# Altium schematic sheet EFR32xG1x_DISC_WIDEBAND_REF_DES_A00_01_Title_Page.SchDoc
size 420 x 297 mm
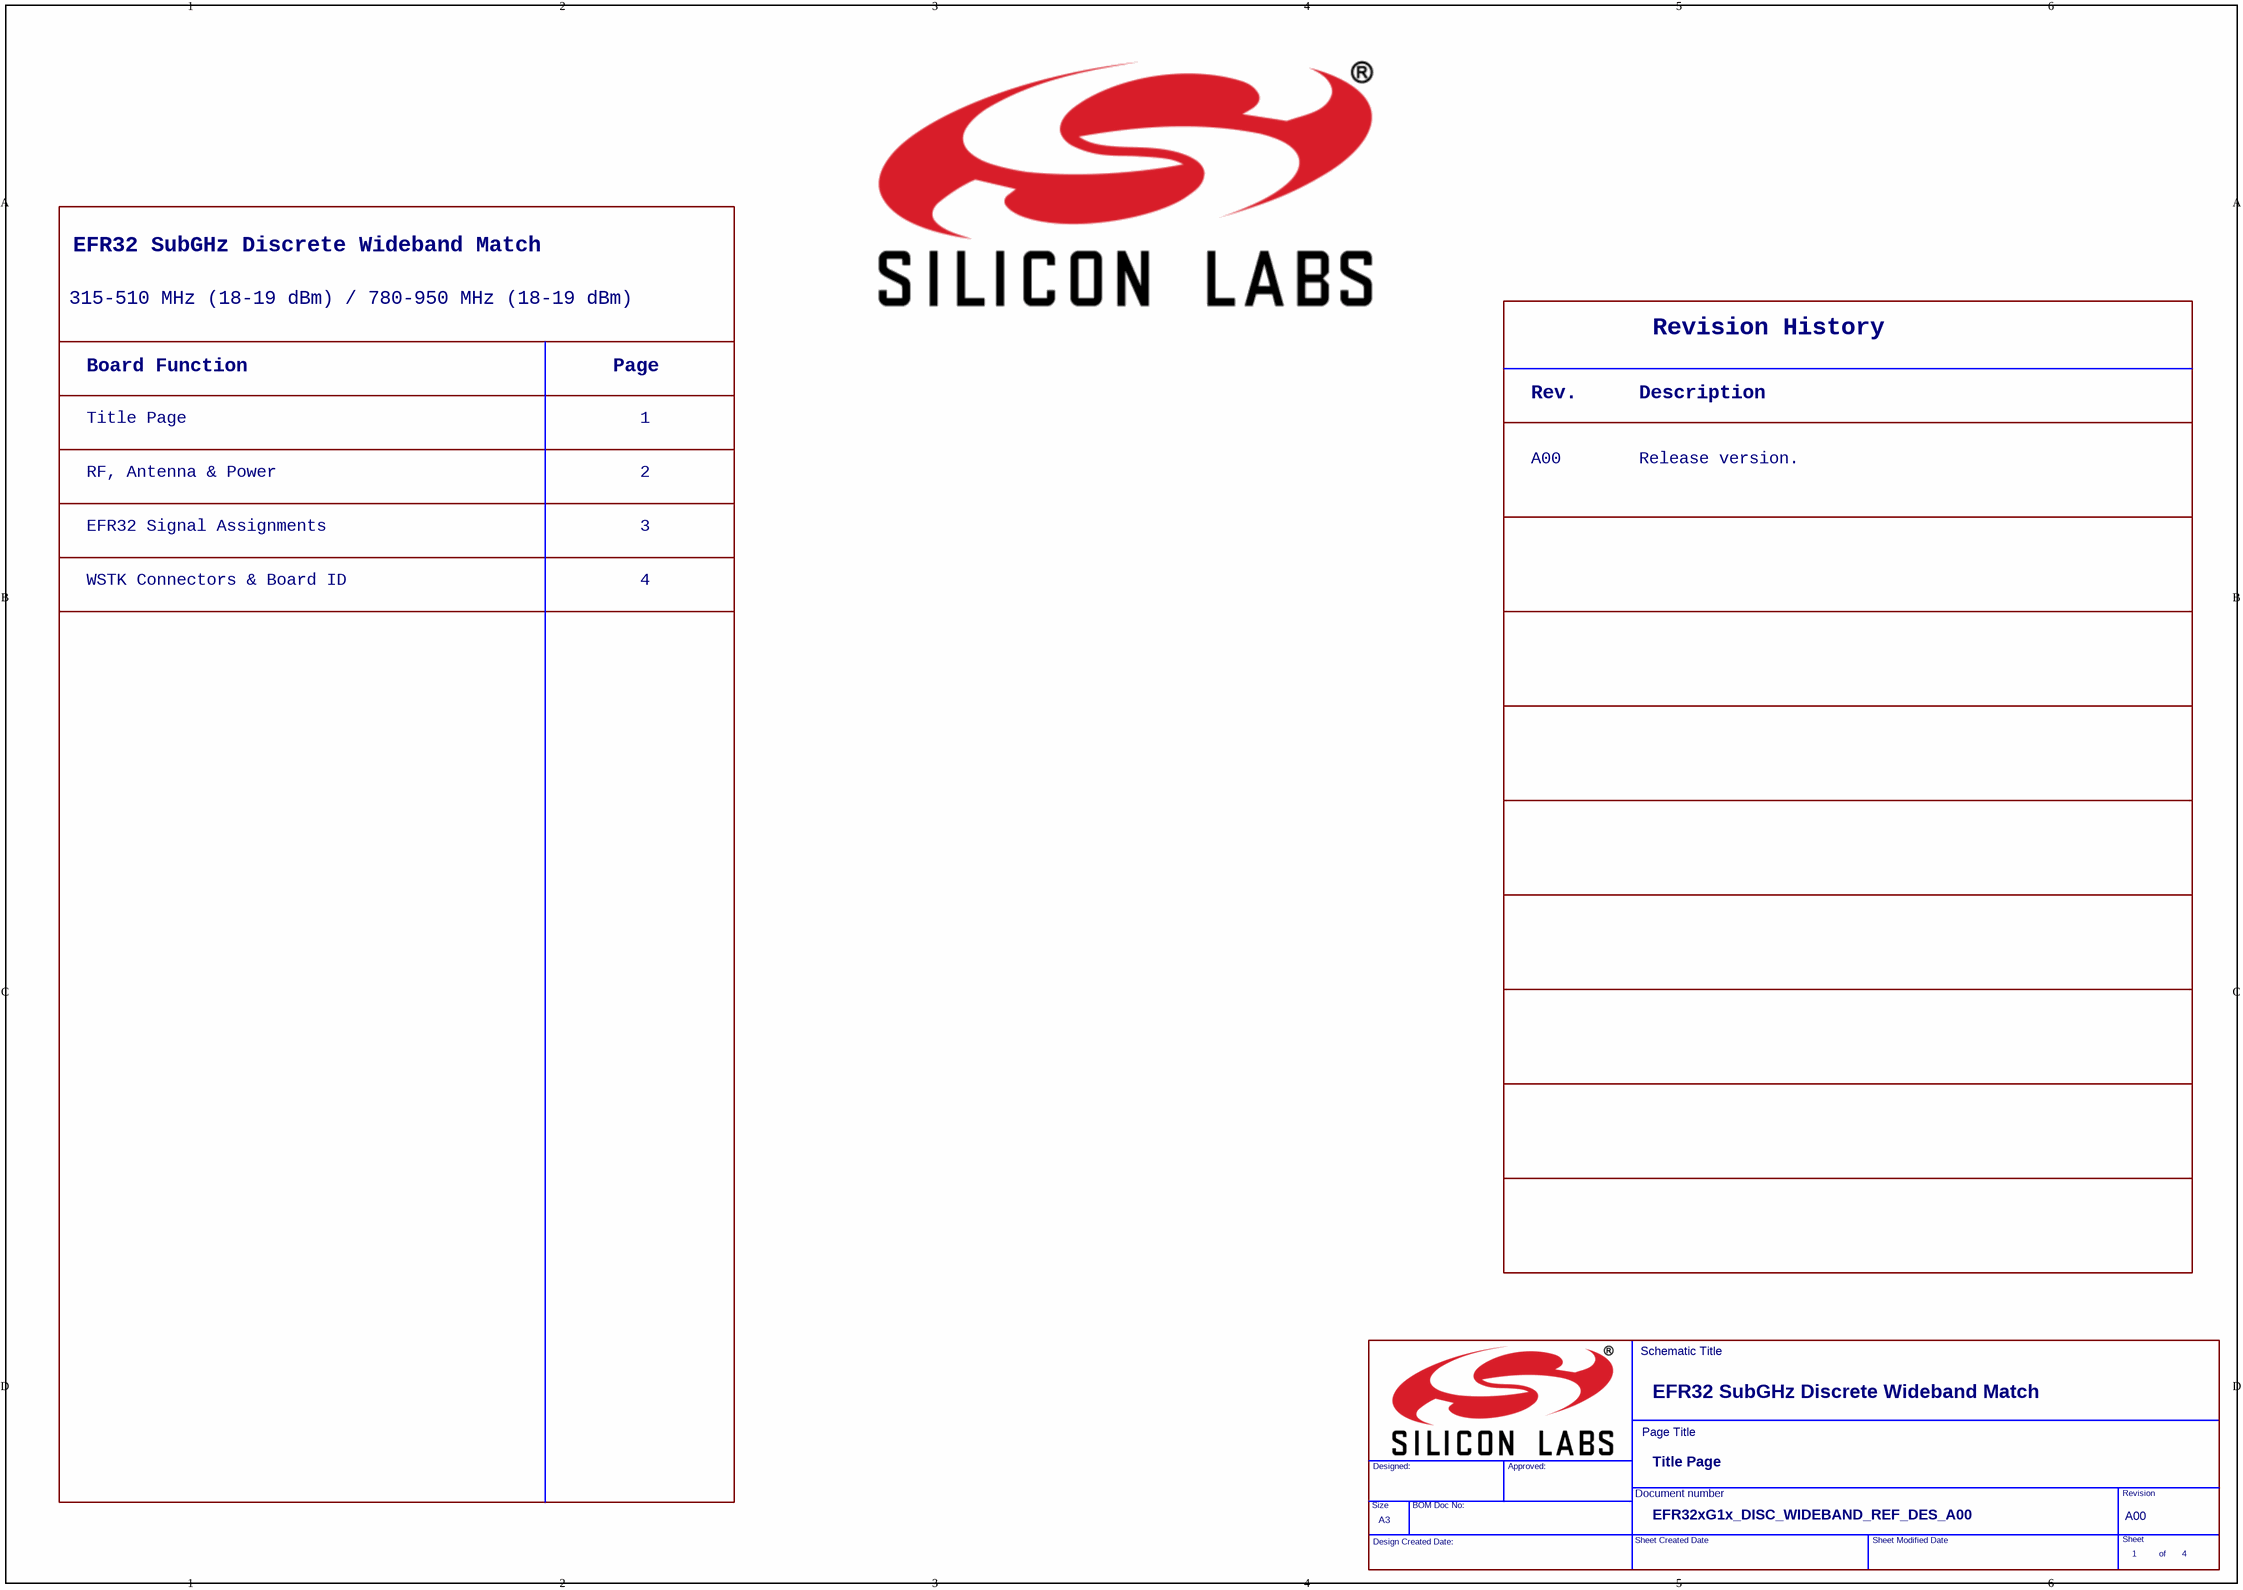
[diagram p0: EFR32xG1x_DISC_WIDEBAND_REF_DES_A00_01_Title_Page.SchDoc]

## Parts
(Parts that share a designator on the sheet are numbered #1, #2 ... from top to bottom, then left to right.)
*#1  Header A: EFR32 SubGHz Discrete Wideband Match  (hidden comment: Toc_Header)  (graphical)
*#2  Rev1: A00  Dscr1A: Release version.  (hidden comment: Rev_History)  (graphical)
*#3  Page Title: Title Page  Page Size: A3  RevCode: A00  Title: EFR32 SubGHz Discrete Wideband Match  Doc: EFR32xG1x_DISC_WIDEBAND_REF_DES_A00  Page Number: 1  Page Count: 4  (hidden comment: TitleBlock_EnergyMicro_A3)  (graphical)

## Notes on the sheet
- 315-510 MHz (18-19 dBm) / 780-950 MHz (18-19 dBm)
- Board Function
- Page
- Title Page
- 1
- EFR32 Signal Assignments
- RF, Antenna & Power
- 2
- 3
- WSTK Connectors & Board ID
- 4
- (in symbol Rev_History) Revision History; Rev.; Description
- (in symbol TitleBlock_EnergyMicro_A3) Schematic Title; Page Title; Designed:; Approved:; Document number; Revision; Size; BOM Doc No:; Sheet; Design Created Date:; Sheet Created Date; Sheet Modified Date; of

## Library data of the parts
*#1 = Toc_Header: Doc: BRD4150A; Page Count: 5; Page Number: 1; OrgName: Silicon Labs; RevCode: PC02
*#2 = Rev_History: Rev2: PC01; Rev3: PC02; Rev5: B00; Rev6: B01; Dscr3A: Updated sub-GHz matching network from; Dscr2A: Moved SENSOR_ENABLE.; Dscr3B: 14 dBm to 13 dBm; Dscr6A: Updated EFR32MG to Rev B0.; Dscr5A: Tuned PCB antenna and updated RF; Dscr4A: First release.; Dscr5B: matching.; Page Count: 5; Page Number: 1; OrgName: Silicon Labs; OrgAddr1: JSH; OrgAddr2: JNO; Title: EFR32MG Dual Band 2400/868 MHz Radio Board; Doc: BRD4150A; Rev4: A00; RevCode: PC02